# Altium schematic sheet bvm.SchDoc
size A2
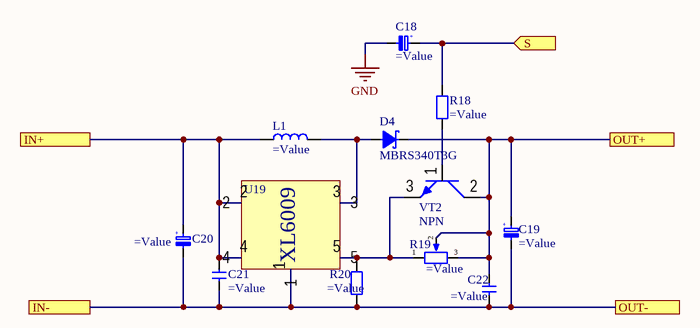
[diagram p0: bvm.SchDoc]

## Parts
C18  (no value)  [D6.6C6.6H6.1]
C19  (no value)  [D8C3.2H12]
C20  (no value)  [D8C3.2H12]
C21  (no value)  [cap0603]
C22  (no value)  [cap0603]
D4  MBRS340T3G  [DO214AB(SMC)]
L1  (no value)  [SRR1280]
R18  (no value)  [res0603]
R19  (no value)  [3224W]
R20  (no value)  [res0603]
U19  (no value)  [TO263S-5+1]
VT2  NPN  [SOT23-3_A]

## Ports
IN+, IN-, OUT+, OUT-, S (in)

## Nets
GND: C18.2(MINUS)
IN+: C20.1(PLUS) C21.2 L1.1 U19.2 U19.4 ; port IN+
IN-: C19.2(MINUS) C20.2(MINUS) C21.1 C22.1 R20.1 U19.1 ; port IN-, port OUT-
OUT+: C19.1(PLUS) C22.2 D4.2 R19.2 R19.3 VT2.2 ; port OUT+
S: C18.1(PLUS) R18.2 ; port S
NetD4_1: D4.1 L1.2 U19.3
NetR18_1: R18.1 VT2.1
NetR19_1: R19.1 R20.2 U19.5 VT2.3

## Notes on the sheet
- (in symbol Cap Aluminum) +
- (in symbol Cap Electrolytic) +

## Library data of the parts
C18 = Cap Electrolytic
C19 C20 = Cap Aluminum
C21 C22 = Cap SMD
L1 = Inductor
R18 R20 = Resistor SMD
R19 = Potentiometer
U19 = XL6009